# EAGLE design Shield_Cutter-V1 (EAGLE 8.2.2)
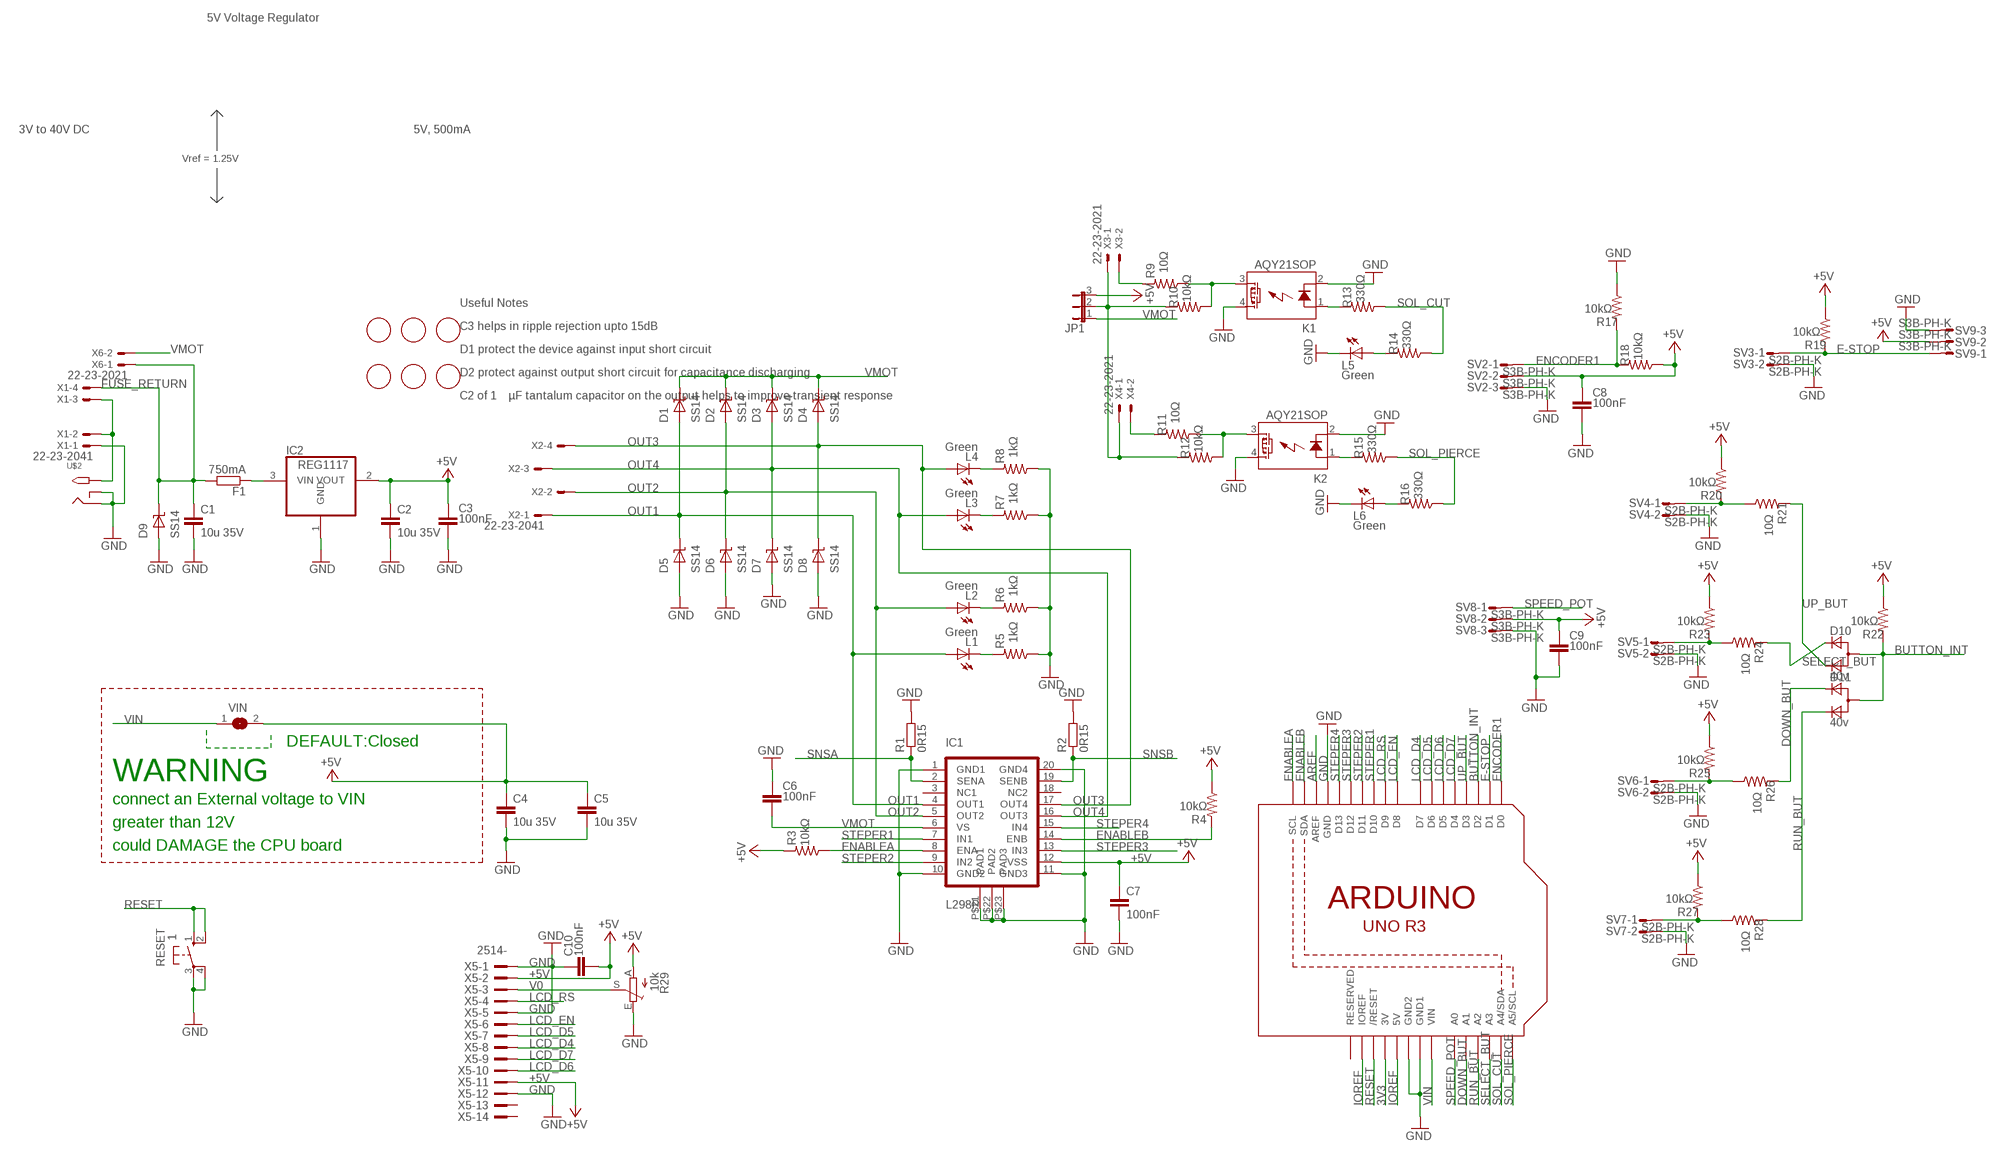
[diagram p0: schematic, sheet 1]

## Parts
C1  10u 35V  C-EUC1210  [C1210]
C2  10u 35V  C-EUC1210  [C1210]
C3  100nF  C-EUC0805  [C0805]
C4  10u 35V  C-EUC1210  [C1210]
C5  10u 35V  C-EUC1210  [C1210]
C6  100nF  C-EUC0805  [C0805]
C7  100nF  C-EUC0805  [C0805]
C8  100nF  C-EUC0805  [C0805]
C9  100nF  C-EUC0805  [C0805]
C10  100nF  C-EUC0805  [C0805]
D1  SS14  [SMA]
D2  SS14  [SMA]
D3  SS14  [SMA]
D4  SS14  [SMA]
D5  SS14  [SMA]
D6  SS14  [SMA]
D7  SS14  [SMA]
D8  SS14  [SMA]
D9  SS14  [SMA]
D10  40v  D_2CSOT323  [SOT323]
D11  40v  D_2CSOT323  [SOT323]
F1  750mA  R-EU_R1206  [R1206]
FID1  FIDUCIALMOUNT  [FIDUCIA-MOUNT]
FID2  FIDUCIALMOUNT  [FIDUCIA-MOUNT]
FID3  FIDUCIALMOUNT  [FIDUCIA-MOUNT]
FID4  FIDUCIALMOUNT  [FIDUCIA-MOUNT]
FID5  FIDUCIALMOUNT  [FIDUCIA-MOUNT]
FID6  FIDUCIALMOUNT  [FIDUCIA-MOUNT]
IC1  L298P  [POWER-SO20]
IC2  REG1117  [SOT223]
JP1  JP2E  [JP2]
K1  AQY21SOP  [SOP04]
K2  AQY21SOP  [SOP04]
L1  Green  LEDCHIPLED_0805  [CHIPLED_0805]
L2  Green  LEDCHIPLED_0805  [CHIPLED_0805]
L3  Green  LEDCHIPLED_0805  [CHIPLED_0805]
L4  Green  LEDCHIPLED_0805  [CHIPLED_0805]
L5  Green  LEDCHIPLED_0805  [CHIPLED_0805]
L6  Green  LEDCHIPLED_0805  [CHIPLED_0805]
R1  0R15  R-EU_R1206  [R1206]
R2  0R15  R-EU_R1206  [R1206]
R3  10kΩ  R-US_R0805  [R0805]
R4  10kΩ  R-US_R0805  [R0805]
R5  1kΩ  R-US_R0805  [R0805]
R6  1kΩ  R-US_R0805  [R0805]
R7  1kΩ  R-US_R0805  [R0805]
R8  1kΩ  R-US_R0805  [R0805]
R9  10Ω  R-US_R0805  [R0805]
R10  10kΩ  R-US_R0805  [R0805]
R11  10Ω  R-US_R0805  [R0805]
R12  10kΩ  R-US_R0805  [R0805]
R13  330Ω  R-US_R0805  [R0805]
R14  330Ω  R-US_R0805  [R0805]
R15  330Ω  R-US_R0805  [R0805]
R16  330Ω  R-US_R0805  [R0805]
R17  10kΩ  R-US_R0805  [R0805]
R18  10kΩ  R-US_R0805  [R0805]
R19  10kΩ  R-US_R0805  [R0805]
R20  10kΩ  R-US_R0805  [R0805]
R21  10Ω  R-US_R0805  [R0805]
R22  10kΩ  R-US_M0805  [M0805]
R23  10kΩ  R-US_R0805  [R0805]
R24  10Ω  R-US_R0805  [R0805]
R25  10kΩ  R-US_R0805  [R0805]
R26  10Ω  R-US_R0805  [R0805]
R27  10kΩ  R-US_R0805  [R0805]
R28  10Ω  R-US_R0805  [R0805]
R29  10k  TRIM_EU-S64W  [S64W]
RESET  1  10-XX  [B3F-10XX]
SV2  S3B-PH-K  S03P  [S03P]
SV3  S2B-PH-K  S02P  [S02P]
SV4  S2B-PH-K  S02P  [S02P]
SV5  S2B-PH-K  S02P  [S02P]
SV6  S2B-PH-K  S02P  [S02P]
SV7  S2B-PH-K  S02P  [S02P]
SV8  S3B-PH-K  S03P  [S03P]
SV9  S3B-PH-K  S03P  [S03P]
U1  ARDUINOR3-DIMENSION  [ARDUINOR3]
U$2  2.1MMJACKTHM  [PJ-102A]
VIN  SJW  [SJW]
X1  22-23-2041  [22-23-2041]
X2  22-23-2041  [22-23-2041]
X3  22-23-2021  [22-23-2021]
X4  22-23-2021  [22-23-2021]
X5  2514-  [PAK100/2500-14]
X6  22-23-2021  [22-23-2021]

## Nets
3V3: U1.3V
+5V [power]: C2.1 C3.1 C4.1 C5.1 C7.1 C8.1 C9.1 C10.2 IC1.P$12(VSS) IC2.2(VOUT) JP1.3 R3.2 R4.1 R18.1 R19.1 R20.1 R22.1 R23.1 R25.1 R27.1 R29.A SV2.2 SV8.2 SV9.2 VIN.2 X5.2 X5.11
AREF: U1.AREF
BUTTON_INT: D10.1(A) D11.1(A) R22.2 U1.D2
DOWN_BUT: D11.2(C1) R26.2 U1.A1
E-STOP: R19.2 SV3.1 SV9.1 U1.D1
ENABLEA: IC1.P$8(ENA) R3.1 U1.SCL
ENABLEB: IC1.P$14(ENB) R4.2 U1.SDA
ENCODER1: R17.2 R18.2 SV2.1 U1.D0
FUSE_RETURN: C1.1 D9.P$1(K) F1.2 X1.4 X6.1
GND [power]: C1.2 C2.2 C3.2 C4.2 C5.2 C6.1 C7.2 C8.2 C9.2 C10.1 D5.P$2(A) D6.P$2(A) D7.P$2(A) D8.P$2(A) D9.P$2(A) IC1.P$1(GND1) IC1.P$10(GND2) IC1.P$11(GND3) IC1.P$20(GND4) IC1.P$21(PAD1) IC1.P$22(PAD2) IC1.P$23(PAD3) IC2.1(GND) K1.2(K) K1.4(DS1) K2.2(K) K2.4(DS1) L5.C L6.C R1.2 R2.2 R5.1 R6.1 R7.1 R8.1 R17.1 R29.E RESET.3(P) RESET.4(P1) SV2.3 SV3.2 SV4.2 SV5.2 SV6.2 SV7.2 SV8.3 SV9.3 U1.GND U1.GND1 U1.GND2 U$2.RING U$2.RING_SW X1.1 X5.1 X5.5 X5.12
IOREF: U1.5V U1.IOREF
LCD_D4: U1.D7 X5.8
LCD_D5: U1.D6 X5.7
LCD_D6: U1.D5 X5.10
LCD_D7: U1.D4 X5.9
LCD_EN: U1.D8 X5.6
LCD_RS: U1.D9 X5.4
N$1: L4.C R8.2
N$2: L3.C R7.2
N$3: L2.C R6.2
N$4: L1.C R5.2
N$5: K1.1(A) R13.2
N$7: L5.A R14.2
N$8: R9.2 X3.2
N$9: R23.2 R24.1 SV5.1
N$10: JP1.2 R10.2 R12.2 X3.1 X4.1
N$11: K2.3(DS2) R11.1 R12.1
N$12: L6.A R16.2
N$13: R20.2 R21.1 SV4.1
N$14: K2.1(A) R15.2
N$15: R11.2 X4.2
N$16: K1.3(DS2) R9.1 R10.1
N$17: R25.2 R26.1 SV6.1
N$18: F1.1 IC2.3(VIN)
N$19: R27.2 R28.1 SV7.1
OUT1: D1.P$2(A) D5.P$1(K) IC1.P$4(OUT1) L1.A X2.1
OUT2: D2.P$2(A) D6.P$1(K) IC1.P$5(OUT2) L2.A X2.2
OUT3: D4.P$2(A) D8.P$1(K) IC1.P$17(OUT4) L4.A X2.4
OUT4: D3.P$2(A) D7.P$1(K) IC1.P$16(OUT3) L3.A X2.3
POWERIN [power]: U$2.TIP X1.2 X1.3
RESET: RESET.1(S) RESET.2(S1) U1.RESET(/RESET)
RUN_BUT: D11.3(C2) R28.2 U1.A2
SELECT_BUT: D10.2(C1) R24.2 U1.A3
SNSA: IC1.P$2(SENA) R1.1
SNSB: IC1.P$19(SENB) R2.1
SOL_CUT: R13.1 R14.1 U1.A4(A4/SDA)
SOL_PIERCE: R15.1 R16.1 U1.A5(A5/SCL)
SPEED_POT: SV8.1 U1.A0
STEPER1: IC1.P$7(IN1) U1.D10
STEPER2: IC1.P$9(IN2) U1.D11
STEPER3: IC1.P$13(IN3) U1.D12
STEPER4: IC1.P$15(IN4) U1.D13
UP_BUT: D10.3(C2) R21.2 U1.D3
V0: R29.S X5.3
VIN [VIN]: U1.VIN VIN.1
VMOT: C6.2 D1.P$1(K) D2.P$1(K) D3.P$1(K) D4.P$1(K) IC1.P$6(VS) JP1.1 X6.2
Unconnected: IC1.P$3(NC1) IC1.P$18(NC2) U1.RESERVED X5.13 X5.14

## Notes on the sheet
- 5V Voltage Regulator
- 3V to 40V DC | 5V, 500mA
- Vref = 1.25V
- Useful Notes
- C3 helps in ripple rejection upto 15dB
- D1 protect the device against input short circuit
- D2 protect against output short circuit for capacitance discharging
- C2 of 1 �µF tantalum capacitor on the output helps to improve transient response
- DEFAULT:Closed
- WARNING
- connect an External voltage to VIN
- greater than 12V
- could DAMAGE the CPU board

## Library data of the parts
C1 C2 C4 C5 C7 = SmartPrj:C-EU: CAPACITOR, European symbol
C3 C6 C8-C10 = rcl:C-EU: CAPACITOR, European symbol
D1-D9 = SmartPrj:SS14: DIODE SS14 Diode Schottky 1A 40v
D10 D11 = zetex:D_2C: Dual DIODE; OC_FARNELL: unknown; OC_NEWARK: unknown
F1 R1 R2 = SmartPrj:R-EU_: RESISTOR, European symbol
FID1-FID6 = SmartPrj:FIDUCIALMOUNT
IC1 = SmartPrj:L298P: L298P DUAL FUL-BRIDGE DRIVER PowerSO20
IC2 = burr-brown:REG1117: 800mA and 1A Low Dropout (LDO) Positive Regulator 1.8V, 2.5V, 2.85V, 3.3V, 5V, and Adj; MPN: REG1117; OC_FARNELL: 1097566; OC_NEWARK: 14P6981
JP1 = jumper:JP2E: JUMPER
K1 K2 = relay:AQY*: PhotoMOS Relay NAiS Source: http://www.panasonic-electric-works.com/catalogues/downloads/photomos/ds_x615_en_aqz10_20.pdf; OC_FARNELL: unknown; OC_NEWARK: unknown
L1-L6 = led:LED: LED OSRAM: - CHIPLED LG R971, LG N971, LY N971, LG Q971, LY Q971, LO R971, LY R971 LH N974, LH R974 LS Q976, LO Q976, LY Q976 LO Q996 - Hyper CHIPLED LW Q18S LB Q993, LB Q99A, LB R99A - SideLED LS A670, LO A670, LY A670, LG A670, LP A670 LB A673, LV A673, LT A673, LW A673 LH A674 LY A675 LS A676, LA A676, LO A676, LY A676, LW A676 LS A679, LY A679, LG A679 - Hyper Micro SIDELED® LS Y876, LA Y876, LO Y876, LY Y876 LT Y87S - SmartLED LW L88C, LW L88S LB L89C, LB L89S, LG L890 LS L89K, LO L89K, LY L89K LS L896, LA L896, LO L896, LY L896 - TOPLED LS T670, LO T670, LY T670, LG T670, LP T670 LSG T670, LSP T670, LSY T670, LOP T670, LYG T670 LG T671, LOG T671, LSG T671 LB T673, LV T673, LT T673, LW T673 LH T674 LS T676, LA T676, LO T676, LY T676, LB T676, LH T676, LSB T676, LW T676 LB T67C, LV T67C, LT T67C, LS T67K, LO T67K, LY T67K, LW E67C LS E67B, LA E67B, LO E67B, LY E67B, LB E67C, LV E67C, LT E67C LW T67C LS T679, LY T679, LG T679 LS T770, LO T770, LY T770, LG T770, LP T770 LB T773, LV T773, LT T773, LW T773 LH T774 LS E675, LA E675, LY E675, LS T675 LS T776, LA T776, LO T776, LY T776, LB T776 LHGB T686 LT T68C, LB T68C - Hyper Mini TOPLED® LB M676 - Mini TOPLED Santana® LG M470 LS M47K, LO M47K, LY M47K Source: http://www.osram.convergy.de LUXEON: - LUMILED® LXK2-PW12-R00, LXK2-PW12-S00, LXK2-PW14-U00, LXK2-PW14-V00 LXK2-PM12-R00, LXK2-PM12-S00, LXK2-PM14-U00 LXK2-PE12-Q00, LXK2-PE12-R00, LXK2-PE12-S00, LXK2-PE14-T00, LXK2-PE14-U00 LXK2-PB12-K00, LXK2-PB12-L00, LXK2-PB12-M00, LXK2-PB14-N00, LXK2-PB14-P00, LXK2-PB14-Q00 LXK2-PR12-L00, LXK2-PR12-M00, LXK2-PR14-Q00, LXK2-PR14-R00 LXK2-PD12-Q00, LXK2-PD12-R00, LXK2-PD12-S00 LXK2-PH12-R00, LXK2-PH12-S00 LXK2-PL12-P00, LXK2-PL12-Q00, LXK2-PL12-R00 Source: www.luxeon.com KINGBRIGHT: KA-3528ASYC Source: www.kingbright.com
R3-R28 = resistor:R-US_: RESISTOR, American symbol
R29 = pot:TRIM_EU-: POTENTIOMETER
RESET = switch-omron:10-XX: OMRON SWITCH; MPN: B3F-1000; OC_FARNELL: 176432; OC_NEWARK: 36M3542
SV2 SV8 SV9 = con-amp-mt:S03P: AMP MT CONNECTOR; OC_FARNELL: unknown; OC_NEWARK: unknown
SV3-SV7 = con-amp-mt:S02P: AMP MT CONNECTOR; OC_FARNELL: unknown; OC_NEWARK: unknown
U1 = adafruit:ARDUINOR3: This is a new object for the new Arduino R3 - with extra pins that you may want to use (such as IOref, and duplicated A4/A5
U$2 = adafruit:2.1MMJACK: 2.1mm x 5.5mm THM DC jack with internal switch. Digikey part #PJ-102A, 4UCON part #05537 2.1mm x 5.5mm SMT DC jack with internal switch. Digikey part #PJ-002A-SMT, 4UCON part #03267 By microbuilder.eu & adafruit.com
VIN = jumper:SJ: SMD solder JUMPER
X1 X2 = con-molex:22-23-2041: .100" (2.54mm) Center Header - 4 Pin; MF: MOLEX; MPN: 22-23-2041; OC_FARNELL: 1462920; OC_NEWARK: 38C0355
X3 X4 X6 = con-molex:22-23-2021: .100" (2.54mm) Center Header - 2 Pin; MF: MOLEX; MPN: 22-23-2021; OC_FARNELL: 1462926; OC_NEWARK: 25C3832
X5 = con-3m:2514-: 3M (TM) Pak 100 4-Wall Header Source: 3M; OC_FARNELL: unknown; OC_NEWARK: unknown

## Net classes
0 default: width 0.406 mm, drill 0.61 mm, clearance 0.152 mm
1 power: width 0.406 mm, drill 0.61 mm, clearance 0.152 mm
2 VIN: width 0.406 mm, drill 0.61 mm, clearance 0.152 mm
3 usbvcc: width 0.254 mm, drill 0.61 mm, clearance 0.254 mm
4 aref: width 0.254 mm, drill 0.61 mm, clearance 0.254 mm

## Board
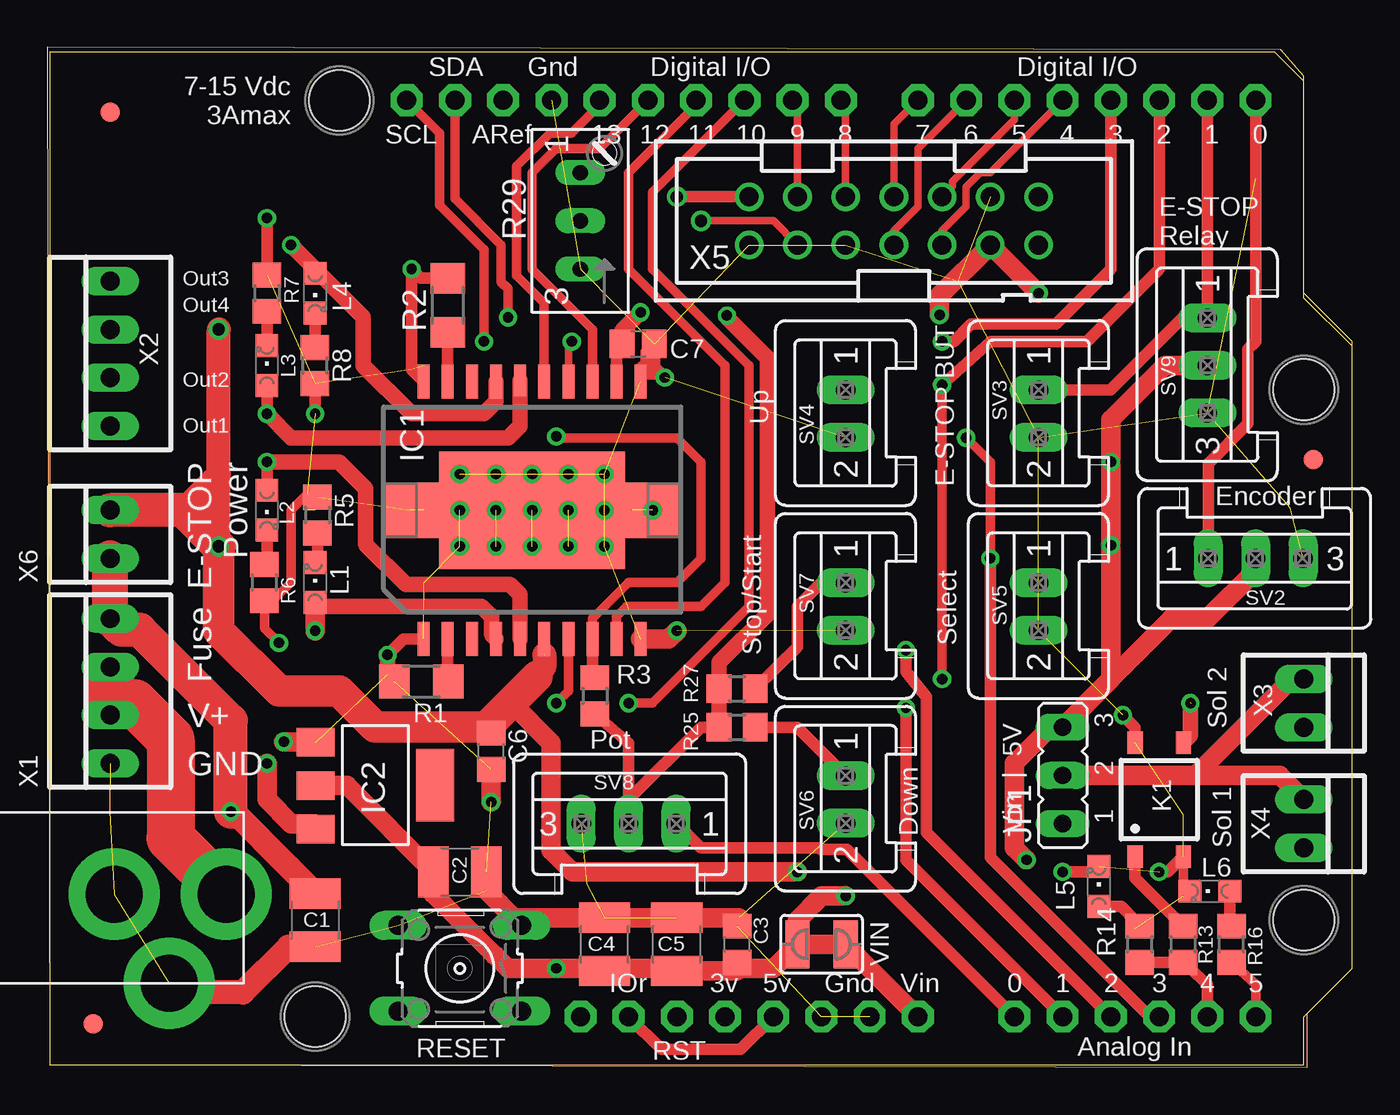
[diagram p1: board, top side]
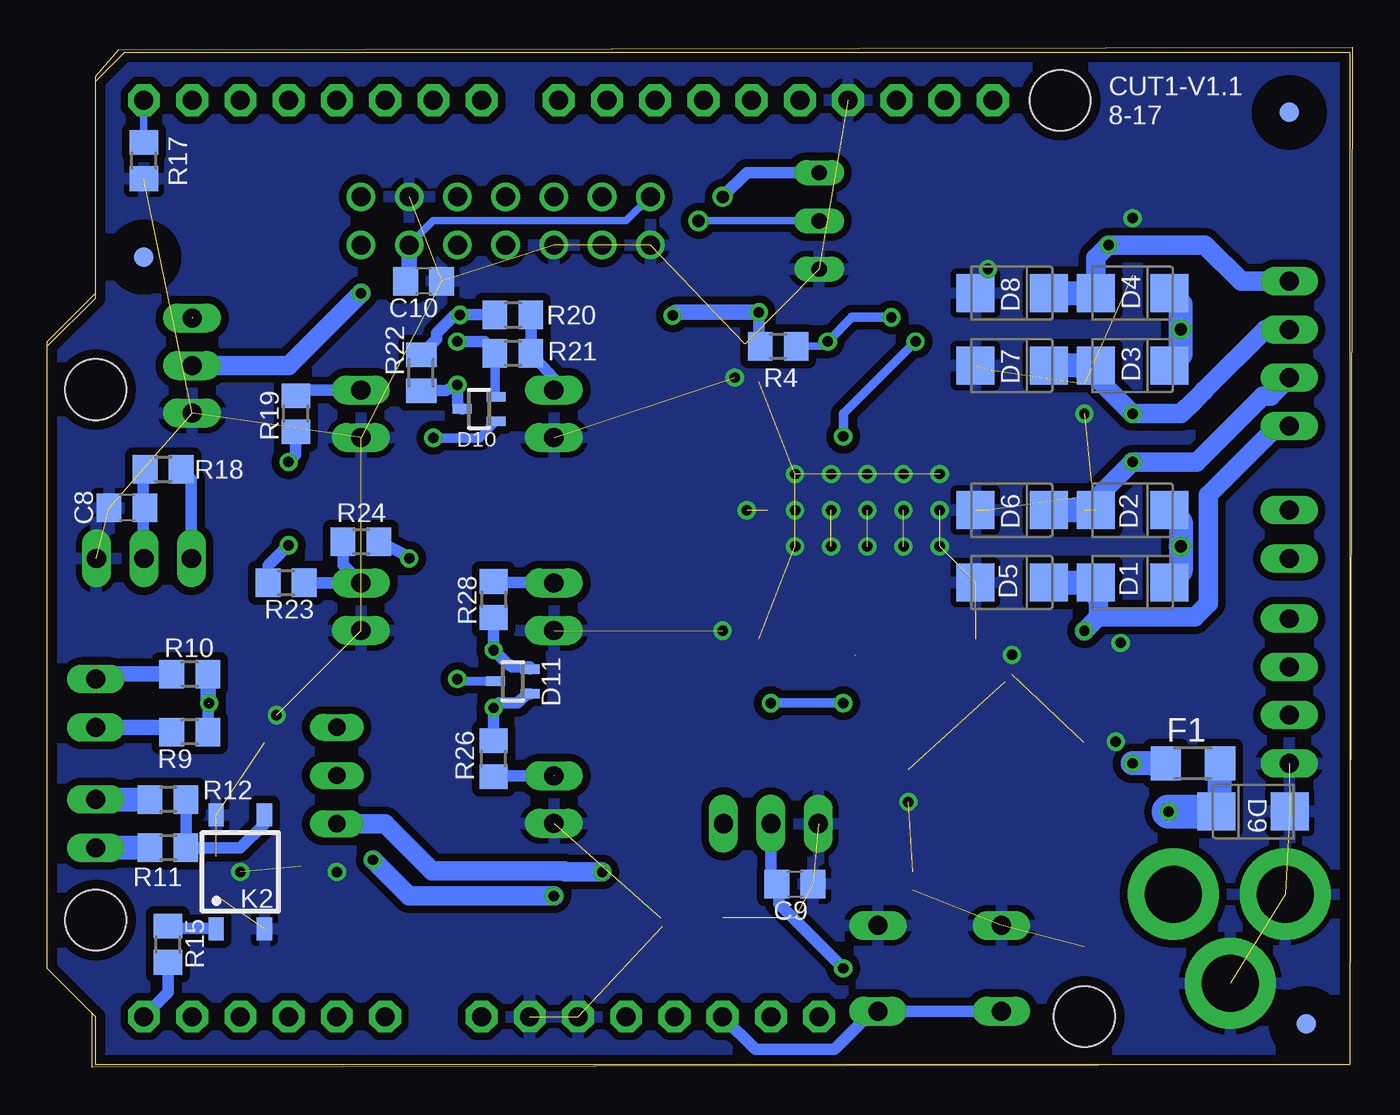
[diagram p2: board, bottom side, seen from below]

Size 68.71 x 53.71 mm. Coordinates in mm from the lower left corner, seen from the top.
Outline: 0.13,0.13 66.34,0 66.34,2.84 68.71,5.21 68.71,38.23 66.17,40.77 66.17,52.2 64.95,53.58 0,53.71 0.13,0.13
Copper layers (1*16): Top 0.035mm / dielectric 1.5mm / Bottom 0.035mm
Design rules "default *": minimum track width 8mil, minimum drill 0.35mm, track to track 12mil, track to pad 12mil, pad to pad 12mil, via to via 12mil, smd to smd 12mil, copper to edge 20mil, drill to drill 12mil, minimum pad ring 10mil, minimum via ring 8mil, stop-mask expansion 8mil, vias tented up to drill 0mil, thermal gap 12mil
Holes 3.2 mm at 15.37,50.93 66.17,35.69 66.17,7.75 14.1,2.67

### Footprints (pad centres in the part's own frame; a part is rotated, then mirrored left to right if it is on the bottom)
C1210 = smd 1.6 x 2.7: 1 -1.4,0; 2 1.4,0
C0805 = smd 1.3 x 1.5: 1 -0.95,0; 2 0.95,0
C0805' = smd 1.3 x 1.5: 1 -0.85,0; 2 0.85,0
SMA = smd 2 x 2: P$1 -1.94,0; P$2 1.94,0
SOT323 = smd 0.5 x 1: 1 0,0.9; 2 -0.65,-0.9; 3 0.65,-0.9
R1206 = smd 1.6 x 1.803: 1 -1.422,0; 2 1.422,0
FIDUCIA-MOUNT = smd 1.016 x 1.016: P$1 0,0
POWER-SO20 = smd 0.635 x 1.778: P$1 -5.715,-6.782; P$2 -4.445,-6.782; P$3 -3.175,-6.782; P$4 -1.905,-6.782; P$5 -0.635,-6.782; P$6 0.635,-6.782; P$7 1.905,-6.782; P$8 3.175,-6.782; P$9 4.445,-6.782; P$10 5.715,-6.782; P$11 5.715,6.782; P$12 4.445,6.782; P$13 3.175,6.782; P$14 1.905,6.782; P$15 0.635,6.782; P$17 -1.905,6.782; P$18 -3.175,6.782; P$19 -4.445,6.782; P$20 -5.715,6.782 | smd 0.635 x 1.651: P$16 -0.635,6.833 | smd 9.804 x 6.198: P$21 0,0 | smd 3.048 x 2.921: P$22 -6.426,0; P$23 6.426,0
SOT223 = smd 1.499 x 2.007: 1 -2.261,-3.15; 2 0.025,-3.15; 3 2.311,-3.15 | smd 3.81 x 2.007: 4 0,3.15
JP2 = drill 0.914 long: 1 -2.54,0; 2 0,0; 3 2.54,0
SOP04 = smd 0.8 x 1.2: 1 -1.27,-3; 2 1.27,-3; 3 1.27,3; 4 -1.27,3
CHIPLED_0805 = smd 1.2 x 1.2: A 0,-1.05; C 0,1.05
R0805 = smd 1.3 x 1.5: 1 -0.95,0; 2 0.95,0
M0805 = smd 1.3 x 1.6: 1 -0.95,0; 2 0.95,0
S64W = drill 0.813 long: A 2.54,1.27; E -2.54,1.27; S 0,1.27
B3F-10XX = drill 1.016 long: 1 -3.251,2.261; 2 3.251,2.261; 3 -3.251,-2.261; 4 3.251,-2.261
S03P = drill 1.016 long: 1 2.5,0; 2 0,0; 3 -2.5,0
S02P = drill 1.016 long: 1 1.25,0; 2 -1.25,0
ARDUINOR3 = drill 1 pad 1.676 octagon: 3V 35.56,2.54; 5V 38.1,2.54; A0 50.8,2.54; A1 53.34,2.54; A2 55.88,2.54; A3 58.42,2.54; A4 60.96,2.54; A5 63.5,2.54; AREF 23.876,50.8; D0 63.5,50.8; D1 60.96,50.8; D2 58.42,50.8; D3 55.88,50.8; D4 53.34,50.8; D5 50.8,50.8; D6 48.26,50.8; D7 45.72,50.8; D8 41.656,50.8; D9 39.116,50.8; D10 36.576,50.8; D11 34.036,50.8; D12 31.496,50.8; D13 28.956,50.8; GND 26.416,50.8; GND1 43.18,2.54; GND2 40.64,2.54; IOREF 30.48,2.54; RESERVED 27.94,2.54; RESET 33.02,2.54; SCL 18.796,50.8; SDA 21.336,50.8; VIN 45.72,2.54
PJ-102A = drill 3 pad 4.8: RING 0.1,-3.39; RING_SW -4.6,-6.29; TIP 0.1,-9.29
SJW = smd 1.27 x 2.54: 1 -1.27,0; 2 1.27,0
22-23-2041 = drill 1 long: 1 -3.81,0; 2 -1.27,0; 3 1.27,0; 4 3.81,0
22-23-2021 = drill 1 long: 1 -1.27,0; 2 1.27,0
PAK100/2500-14 = drill 1 pad 1.422: 1 -7.62,-1.27; 2 -7.62,1.27; 3 -5.08,-1.27; 4 -5.08,1.27; 5 -2.54,-1.27; 6 -2.54,1.27; 7 0,-1.27; 8 0,1.27; 9 2.54,-1.27; 10 2.54,1.27; 11 5.08,-1.27; 12 5.08,1.27; 13 7.62,-1.27; 14 7.62,1.27

### Placement (x,y rotation side)
C1  14.1,7.75 270 top
C2  21.72,10.29 0 top
C3  36.32,6.48 90 top
C4  29.34,6.48 90 top
C5  33.15,6.48 90 top
C6  23.37,16.64 90 top
C7  100nF  [C0805']  31.11,38.1 0 top
C8  64.52,29.46 180 bottom
C9  29.34,9.65 0 bottom
C10  48.9,41.4 180 bottom
D1  11.56,25.53 180 bottom
D2  11.56,29.34 180 bottom
D3  11.56,36.96 180 bottom
D4  11.56,40.77 180 bottom
D5  17.91,25.53 180 bottom
D6  17.91,29.34 180 bottom
D7  17.91,36.96 180 bottom
D8  17.91,40.77 180 bottom
D9  5.21,13.46 0 bottom
D10  45.97,34.67 90 bottom
D11  44.2,20.32 90 bottom
F1  8.38,16 0 bottom
FID1  66.67,32 0 top
FID2  2.41,2.29 0 top
FID3  3.3,50.29 0 top
FID4  2.41,2.29 0 bottom
FID5  3.3,50.29 0 bottom
FID6  63.63,42.67 0 bottom
IC1  25.53,29.34 0 top
IC2  17.27,14.86 270 top
JP1  53.47,15.37 90 top
K1  58.55,14.1 0 top
K2  58.55,10.29 0 bottom
L1  14.1,25.53 0 top
L2  11.56,29.34 180 top
L3  11.56,36.96 0 top
L4  14.1,40.77 180 top
L5  55.37,9.53 0 top
L6  61.21,9.27 90 top
R1  19.68,20.32 180 top
R2  21.08,40.13 90 top
R3  28.83,19.56 270 top
R4  30.23,37.97 0 bottom
R5  14.22,29.08 270 top
R6  11.43,25.53 90 top
R7  11.56,40.77 270 top
R8  14.1,36.96 90 top
R9  61.21,17.65 180 bottom
R10  61.21,20.7 180 bottom
R11  62.36,11.56 180 bottom
R12  62.36,14.1 180 bottom
R13  59.82,6.48 90 top
R14  57.53,6.48 90 top
R15  62.36,6.48 90 bottom
R16  62.36,6.48 90 top
R17  63.63,47.75 90 bottom
R18  62.61,31.5 0 bottom
R19  55.63,34.42 90 bottom
R20  44.2,39.62 0 bottom
R21  44.2,37.59 180 bottom
R22  49.02,36.58 270 bottom
R23  56.13,25.53 0 bottom
R24  52.2,27.69 0 bottom
R25  36.32,17.91 0 top
R26  45.21,16.26 90 bottom
R27  36.32,19.94 0 top
R28  45.21,24.64 270 bottom
R29  29.34,44.58 90 top
RESET  21.72,5.21 180 top
SV2  63.63,26.8 180 top
SV3  52.2,34.42 90 top
SV4  42.04,34.42 90 top
SV5  52.2,24.26 90 top
SV6  42.04,14.1 90 top
SV7  42.04,24.26 90 top
SV8  30.61,12.83 0 top
SV9  61.09,36.96 90 top
U1  0.13,0.13 0 top
U$2  0.13,9.02 90 top
VIN  40.77,6.48 180 top
X1  3.3,19.81 90 top
X2  3.3,37.59 90 top
X3  66.17,19.18 270 top
X4  66.17,12.83 270 top
X5  44.58,44.58 0 top
X6  3.3,28.07 90 top

### Tracks (layer width: path | path; a pad name or v marks a point on that pad's centre or on a via)
+5V  (via drill 0.55, 0.65)
  Top 0.61: R25.1 34.42,17.91 30.61,14.1 SV8.2 30.61,17.08 R3.2 | v33.15,45.85 X5.2 | v26.8,5.21 26.93,5.08 C4.1 | C2.1 20.32,9.13 | IC1.P$12 29.97,37.59 30.27,37.89 C7.1
  Top 0.813: R25.1 R27.1 35.37,21.31 37.92,23.86 37.92,37.36 35.79,39.49 v35.79,39.6 | 30.27,38.68 C7.1 30.27,38.81 31.02,39.56 31.04,39.56 v31.24,39.76 | 36.32,5.08 36.32,5.21 C3.1
  Top 1.016: 20.32,9.13 23.55,5.89 23.57,5.89 24.26,5.21 v26.8,5.21 33.02,5.21 C5.1 36.32,5.08 | VIN.2 39.5,7.75 40.77,9.02 v42.04,9.02 | SV9.2 58.86,36.96 56.01,34.11 v56.01,31.88 v56.01,27.49 56.01,20.45 | v52.2,40.77 X5.11 46.98,40.63 v46.98,39.63 | 36.32,5.21 38.23,5.21 VIN.2 | v51.56,10.92 50.93,11.56 50.93,16 52.83,17.91 JP1.3 56.01,20.45 | 56.01,20.45 59.18,23.62 61.09,23.62 63.63,26.16 SV2.2 | VIN.2 42.04,6.48 | IC2.2 15.77,14.83 C2.1
  Bottom 0.406: C8.1 63.67,26.84 SV2.2 | X5.2 38.23,44.58 48.39,44.58 X5.11
  Bottom 0.61: v26.8,5.21 30.19,8.6 30.19,9.55 C9.1 30.29,9.97 30.61,10.29 SV8.2 | R19.1 55.63,32.26 v56.01,31.88 | R20.1 45.05,39.63 v46.98,39.63 47.25,39.63 48.21,38.68 48.21,38.34 R22.1 | R29.A 31.88,47.12 v33.15,45.85 | v56.01,27.49 57.08,26.42 R23.1 | R18.1 63.67,31.39 63.67,26.84 | R4.1 31.24,38.29 v31.24,39.76
  Bottom 0.813: X5.11 49.66,41.62 C10.2 | v31.24,39.76 35.62,39.76 v35.79,39.6
  Bottom 1.016: v42.04,9.02 49.66,9.02 v51.56,10.92 | SV9.2 56.52,36.96 56.51,36.96 56,36.96 v52.2,40.77
BUTTON_INT  (via drill 0.55)
  Top 0.508: v47.12,20.45 v47.12,35.94
  Top 0.61: v47.12,35.94 49.66,38.23 54.74,38.23 58.55,42.04 U1.D2
  Bottom 0.508: D11.1 47.02,20.34 v47.12,20.45
  Bottom 0.61: R22.2 47.75,35.63 v47.12,35.94 47.12,34.91 D10.1
DOWN_BUT  (via drill 0.55)
  Top 0.61: U1.A1 45.21,10.92 v45.21,18.92
  Bottom 0.61: R26.2 v45.21,18.92 44.96,19.18 43.94,19.18 43.45,19.67 D11.2
E-STOP  (1 unrouted)
  Top 0.61: SV3.1 55.99,35.67 59.82,39.5 60.71,39.5 | 60.71,39.5 61.09,39.5 | U1.D1 61.09,39.88 60.71,39.5
  Bottom 0.61: R19.2 55.33,35.67 SV3.1
ENABLEA  (via drill 0.55)
  Top 0.508: U1.SCL 20.65,49.2 20.65,45.41 22.99,43.07 v22.99,38.23 | v26.8,33.22 26.87,33.15 33.15,33.15 34.42,31.88 34.42,26.8 33.15,25.53 30.61,25.53 28.7,23.62 IC1.P$8
  Top 0.61: 28.7,22.01 IC1.P$8 | 28.7,22.01 28.7,21.08 | R3.1 28.7,20.63 28.7,22.01
  Bottom 0.508: v22.99,38.23 26.8,34.42 v26.8,33.22
ENABLEB  (via drill 0.55)
  Top 0.406: IC1.P$14 27.43,38.23 v27.61,38.23
  Top 0.508: v24.26,39.5 24.26,41.01 23.9,41.36 23.9,43.31 21.46,45.75 U1.SDA
  Bottom 0.406: v27.61,38.23 27.61,37.97 R4.2
  Bottom 0.508: v27.61,38.23 26.34,39.5 v24.26,39.5
ENCODER1
  Top 0.61: SV2.1 61.13,31.79 63.22,33.89 63.22,37.82 63.63,38.23 U1.D0
  Bottom 0.406: R17.2 U1.D0
  Bottom 0.61: R18.2 61.13,30.96 SV2.1
FUSE_RETURN  (via drill 0.55)
  Top 1.27: C1.1 12.76,10.49 12.76,10.5 9.79,13.46 v9.65,13.46
  Top 1.778: X1.4 3.89,23.03 4.86,23.03 9.65,18.24 v9.65,13.46
  Top 1.905: X1.4 X6.1
  Bottom 1.27: D9.P$1 6.96,13.65 F1.2
  Bottom 1.778: v9.65,13.46 D9.P$1
GND  (via drill 0.55)  (54 unrouted)
  Top 0.508: K1.2 59.82,9.02 L6.C | R5.1 13.68,30.19 12.83,29.34 12.83,25.53 11.98,24.68 R6.1 11.43,23.11 v12.19,22.35 | IC1.P$23 v31.88,29.34
  Top 0.61: L5.C 55.08,10.29 v53.47,10.29 | K1.2 59.01,10.29 v58.55,10.29 | R8.1 v14.1,34.42 | R7.1 v11.56,44.73 | IC1.P$1 18.74,22.55 v17.91,21.72 | 17.91,20.68 R1.2 | R2.2 19.66,41.55 v19.18,42.04 19.18,36.75 IC1.P$20 | K1.4 57.28,17.91 v56.64,18.54 | IC1.P$22 v21.72,29.34 v23.62,29.34 IC1.P$21 v27.43,29.34 v29.34,29.34 30.79,29.34 | 31.24,36.51 31.24,36.82 31.52,37.1 31.52,37.66 C7.2 31.96,36.87 v32.51,36.32 32.33,36.51 31.24,36.51 | 31.24,36.51 IC1.P$11
  Top 0.813: v17.91,21.72 17.91,20.68
  Top 1.016: C2.2 23.12,9.32 24.56,7.88 | 24.56,7.88 RESET.3 | 24.56,7.88 C5.2 36.41,7.88 C3.2 | IC1.P$10 32.72,22.55 v33.15,22.99 | C6.1 v23.37,13.97 | v12.45,17.14 14.1,17.14 IC2.1
  Top 1.27: C1.2 12.7,6.35 10.29,3.94 6.42,3.94 U$2.RING_SW
  Bottom 0.61: v19.18,42.04 19.18,41.44 D8.P$2
  Bottom 0.813: 66.17,26.8 SV2.3
  other vias: 25.53,29.34 29.34,31.24 27.43,31.24 25.53,31.24 23.62,31.24 21.72,31.24 21.72,27.43 23.62,27.43 25.53,27.43 27.43,27.43 29.34,27.43
  pour Bottom (isolate 0.406): 0.13,53.47 64.26,53.47 66.17,51.56 66.17,40.13 68.71,37.59 68.71,5.21 66.17,2.67 66.17,0.13 0.13,0.13
IOREF
  Top 0.61: U1.5V 36.5,0.94 32.33,0.94 U1.IOREF
LCD_D4
  Top 0.406: U1.D7 44.58,49.66 X5.8
LCD_D5
  Top 0.406: X5.7 44.58,44.06 45.84,45.32 45.84,48.38 U1.D6
LCD_D6
  Top 0.406: X5.10 47.67,46.4 47.67,46.65 50.93,49.91 U1.D5
LCD_D7
  Top 0.406: U1.D4 49.65,47.11 49.13,47.11 48.38,46.35 48.38,45.32 47.12,44.06 X5.9
LCD_EN
  Top 0.406: U1.D8 42.04,50.67 X5.6
LCD_RS
  Top 0.406: U1.D9 39.5,50.67 X5.4
N$1
  Top 0.61: L4.C R8.2
N$2
  Top 0.61: R7.2 L3.C
N$3
  Top 0.61: L2.C 11.56,26.6 R6.2
N$4
  Top 0.61: R5.2 14.22,26.7 L1.C
N$5
  Top 0.61: R13.2 57.28,9.97 K1.1
N$7
  Top 0.61: L5.A 56.55,8.48 57.28,7.75 R14.2
N$8
  Bottom 0.813: X3.2 62.42,17.91 R9.2
N$9
  Bottom 0.61: R23.2 55.16,25.51 SV5.1 53.15,26.46 R24.1
N$10
  Top 1.016: X4.1 64.9,15.37 60.45,15.37 | 60.45,15.37 JP1.2 | X3.1 65.53,20.45 60.45,15.37
  Bottom 0.813: R10.2 65.91,20.7 X3.1
  Bottom 1.27: X4.1 R12.2
N$11
  Bottom 0.61: R12.1 R11.1 58.55,11.56 57.28,12.83 K2.3
N$12
  Top 0.508: R16.2 62.14,7.55
  Top 0.61: L6.A 62.26,7.52 R16.2
N$13
  Bottom 0.61: R20.2 R21.1 42.04,36.28 SV4.1
N$14
  Bottom 0.61: K2.1 59.86,7.33 62.36,7.33 R15.2
N$15
  Bottom 1.27: R11.2 X4.2
N$16  (via drill 0.55)  (1 unrouted)
  Top 0.813: v60.2,19.18 60.2,17.48 K1.3
  Bottom 0.61: R9.1 60.24,19.16
  Bottom 0.813: 60.24,19.16 R10.1
N$17  (1 unrouted)
  Top 0.61: R25.2 39.5,17.91 42.04,15.37
  Bottom 0.61: R26.1 45.15,15.35 SV6.1
N$18  (via drill 0.55)
  Top 0.813: 14.1,12.83 14.1,12.55 IC2.3
  Top 1.016: v11.56,16 11.56,14.1 12.83,12.83 14.1,12.83
  Bottom 1.27: F1.1 v11.56,16
N$19
  Top 0.61: SV7.1 42.02,25.53 40.77,25.53 39.5,24.26 39.5,22.14 R27.2
  Bottom 0.61: R28.1 45.17,25.53 42.04,25.53 SV7.1
OUT1  (via drill 0.55)
  Top 0.61: 13.88,24.26 L1.A
  Top 0.813: IC1.P$4 23.38,22.8 23.38,23.74 22.86,24.26 13.88,24.26
  Top 1.016: L1.A v14.1,22.99
  Bottom 1.016: X2.1 3.94,33.78 7.57,30.15 7.57,24.42 8.28,23.71 13.37,23.71 | 13.37,23.71 v14.1,22.99 | D1.P$2 13.37,25.4 13.37,23.71
  Bottom 1.27: D5.P$1 D1.P$2 13.5,24.93
OUT2  (via drill 0.55)  (1 unrouted)
  Top 0.61: v11.56,31.88 L2.A
  Top 0.813: IC1.P$5 24.89,24.89 24.36,25.42 18.88,25.42 16.76,27.54 16.76,30.48 15.37,31.88 v11.56,31.88
  Bottom 1.016: 14.1,29.34 v11.56,31.88 8.18,31.88 4.71,35.35 4.27,35.35 X2.2
  Bottom 1.27: D6.P$1 14.1,29.34
OUT3  (via drill 0.55)
  Top 0.61: L4.A 14.1,42.04 v12.83,43.31
  Top 0.813: IC1.P$17 23.62,35.05 22.99,34.42 19.18,34.42 16.64,36.96 16.64,39.5 v12.83,43.31
  Bottom 1.016: D4.P$2 13.5,42.64 v12.83,43.31 7.75,43.31 5.84,41.4 X2.4
  Bottom 1.27: D8.P$1 D4.P$2
OUT4  (via drill 0.55)
  Top 0.61: v11.56,34.42 L3.A
  Top 0.813: IC1.P$16 24.89,33.78 24.26,33.15 12.83,33.15 v11.56,34.42
  Bottom 1.016: 14.1,36.96 v11.56,34.42 9.02,34.42 8.29,35.14 8.28,35.14 7.8,35.62 7.8,35.63 4.57,38.86 X2.3
  Bottom 1.27: D7.P$1 14.1,36.96 D3.P$2
POWERIN
  Top 0.508: X1.3 3.3,20.45 | X1.2 3.3,19.18
  Top 1.905: 3.3,19.18 4.57,19.18
  Top 2.54: 3.3,20.45 3.3,19.18 | 4.57,19.18 6.48,17.27 6.48,12.06 U$2.TIP
RESET
  Bottom 0.61: RESET.2 RESET.1 25.25,2.95 27.25,0.94 31.42,0.94 U1.RESET
RUN_BUT  (via drill 0.55)
  Top 0.61: v45.21,21.97 45.21,20.84 46.3,19.5 46.3,12.37 U1.A2
  Bottom 0.61: R28.2 v45.21,21.97 44.42,21.18 44.34,21.18 44.25,21.08 43.31,21.08 43.3,21.07 D11.3
SELECT_BUT  (via drill 0.55)
  Top 0.508: v48.39,33.15 49.66,31.88 v49.66,26.8
  Top 0.61: U1.A3 58.05,2.67 49.66,11.07 v49.66,26.8
  Bottom 0.508: D10.2 45.95,33.15 v48.39,33.15
  Bottom 0.61: v49.66,26.8 49.66,26.88 R24.2
SNSA
  Top 0.61: IC1.P$2 21.08,20.34 R1.1
SNSB
  Top 0.61: IC1.P$19 R2.1
SOL_CUT
  Top 0.61: U1.A4 61.09,4.36 R13.1 R14.1
SOL_PIERCE
  Top 0.508: R16.1 63.63,4.36 U1.A5
  Bottom 0.61: R16.1 62.36,3.94 U1.A5
SPEED_POT
  Top 0.61: U1.A0 42.12,11.48 40.71,11.48 40.62,11.56 34.42,11.56 33.15,12.83 SV8.1
STEPER1  (via drill 0.55)
  Top 0.508: U1.D10 31.88,46.1 31.88,42.04 36.96,36.96 36.96,24.26 31.88,19.18 v30.61,19.18 | v26.8,19.18 27.43,19.81 IC1.P$7
  Bottom 0.508: v26.8,19.18 v30.61,19.18
STEPER2
  Top 0.508: IC1.P$9 29.97,23.74 30.49,24.26 34.42,24.26 35.69,25.53 35.69,36.96 30.61,42.04 30.61,47.12 34.16,50.67 U1.D11
STEPER3
  Top 0.508: IC1.P$13 28.7,38.86 25.53,42.04 25.53,47.12 26.8,48.39 29.08,48.39 U1.D12
STEPER4
  Top 0.508: U1.D13 29.08,50.67 27.61,49.2 26.46,49.2 24.71,47.45 24.71,41.7 26.16,40.25 IC1.P$15
UP_BUT  (via drill 0.55)
  Top 0.61: U1.D3 56.01,42.04 53.11,39.14 48.64,39.14 47.73,38.23 v47.12,38.23
  Bottom 0.508: D10.3 45.15,35.39 R21.2
  Bottom 0.61: R21.2 45.68,38.23 v47.12,38.23
V0  (via drill 0.65)
  Top 0.406: v34.42,44.58 38.23,44.58 X5.3
  Bottom 0.406: R29.S v34.42,44.58
VIN
  Top 1.016: VIN.1 U1.VIN
VMOT  (via drill 0.55, 0.65)  (1 unrouted)
  Top 0.508: C6.2 22.35,17.59 23,17.59
  Top 0.61: 26.16,21.72 IC1.P$6 | 23,17.92 23.24,18.03
  Top 1.016: v39.5,10.29 27.65,10.29 26.53,11.41 26.53,17.09 24.41,19.21 | 23,17.59 23,17.92
  Top 1.27: 20.02,17.92 20.02,17.91 | 26.17,21.72 26.17,21.09 25.78,20.57 | v9.02,27.43 9.02,31.24 | 9.02,31.24 v9.02,38.86 | 9.02,31.24 7.11,29.34
  Top 1.651: 23.24,18.03 24.41,19.21 25.78,20.57 | 23,17.92 20.02,17.92 17.26,17.92 15.37,19.81 12.19,19.81 9.02,22.99 v9.02,27.43
  Top 1.778: 7.11,29.34 X6.2 | 7.11,29.34 v9.02,27.43 | 7.11,29.34 7.75,29.34 8.38,29.97
  Bottom 1.016: v39.5,10.29 41.44,10.29 41.49,10.34 48.44,10.34 50.93,12.83 JP1.1
  Bottom 1.27: D2.P$1 9.02,28.74 v9.02,27.43 9.02,26.13 D1.P$1 | D4.P$1 9.02,40.17 v9.02,38.86 9.02,37.56 D3.P$1

### Text on the board
_tNames: X1 | LED4 | R11 | R24 | R2 | IC1 | C7 | LED3 | R8 | SV9 | R13 | LED2 | R29 | SV4 | SV3 | X2 | R28 | LED1 | SV1 | X3 | R18 | R21 | R1 | SV7 | SV5 | JP1 | R16 | SV2 | IC2 | SV8 | R30 | X4 | LED7 | C1 | K1 | C4 | SV6 | LED5 | LED6 | C2 | R9 | R10 | R4 | C9 | C10 | VIN-CONNECT | RESET
_bNames: R14 | C6 | R15 | D4 | D8 | R22 | R19 | R23 | D11 | D3 | D7 | R20 | C5 | R25 | D2 | D6 | R17 | R27 | D1 | D5 | R12 | D12 | R3 | D10 | R26 | R5 | R7 | C11 | K2 | R6
top_silk: 7-15 Vdc / 3Amax | E-STOP / Relay | Out3 | Out4 | Out2 | Up | Out1 | E-STOP / Power | E-STOP BUT | Encoder | Fuse | Stop/Start | Select | Sol 2 | V+ | Pot | GND | Down | Vin | 5V | Sol 1
bottom_silk: CUT1-V1.1 / 8-17